# EAGLE design hello (EAGLE 7.5.0)
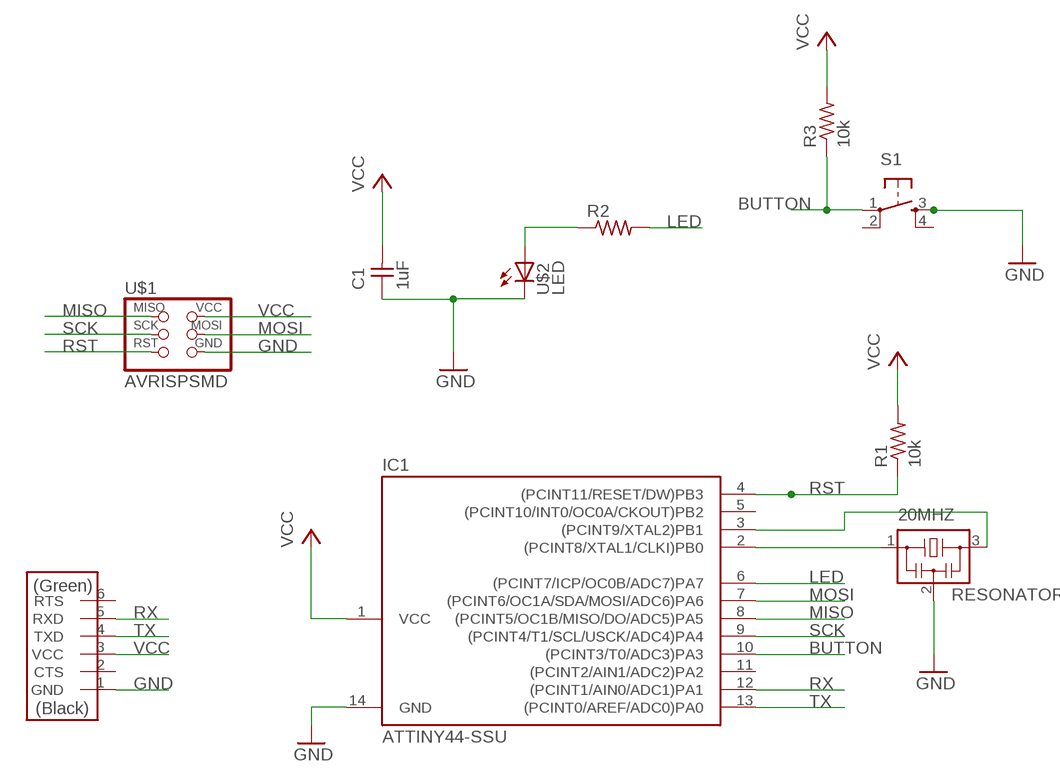
[diagram p0: schematic, sheet 1]

## Parts
20MHZ  RESONATOR  [EFOBM]
C1  1uF  CAP-UNPOLARIZED  [C1206]
IC1  ATTINY44-SSU  [SOIC14]
R1  10k  RES-US1206  [R1206]
R2  RES-US1206  [R1206]
R3  10k  RES-US1206  [R1206]
S1  6MM_SWITCH6MM_SWITCH  [6MM_SWITCH]
U$1  AVRISPSMD  [2X03SMD]
U$2  LED  [LED1206]
U$4  FTDI-SMD-HEADER  [1X06SMD]

## Nets
BUTTON: IC1.10((PCINT3/T0/ADC3)PA3) R3.1 S1.1(P)
GND: 20MHZ.2 C1.1 IC1.14(GND) S1.3(S) U$1.6(GND) U$2.2(C) U$4.1(GND)
LED: IC1.6((PCINT7/ICP/OC0B/ADC7)PA7) R2.2
MISO: IC1.8((PCINT5/OC1B/MISO/DO/ADC5)PA5) U$1.1(MISO)
MOSI: IC1.7((PCINT6/OC1A/SDA/MOSI/ADC6)PA6) U$1.4(MOSI)
N$1: R2.1 U$2.1(A)
N$5: 20MHZ.3 IC1.3((PCINT9/XTAL2)PB1)
N$6: 20MHZ.1 IC1.2((PCINT8/XTAL1/CLKI)PB0)
RST: IC1.4((PCINT11/RESET/DW)PB3) R1.1 U$1.5(RST)
RX: IC1.12((PCINT1/AIN0/ADC1)PA1) U$4.5(RXD)
SCK: IC1.9((PCINT4/T1/SCL/USCK/ADC4)PA4) U$1.3(SCK)
TX: IC1.13((PCINT0/AREF/ADC0)PA0) U$4.4(TXD)
VCC: C1.2 IC1.1(VCC) R1.2 R3.2 U$1.2(VCC) U$4.3(VCC)
Unconnected: IC1.5((PCINT10/INT0/OC0A/CKOUT)PB2) IC1.11((PCINT2/AIN1/ADC2)PA2) S1.2(P1) S1.4(S1) U$4.2(CTS) U$4.6(RTS)

## Library data of the parts
20MHZ = fab:RESONATOR
C1 = fab:CAP-UNPOLARIZED
IC1 = fab:ATTINY44
R1-R3 = fab:RES-US: Resistor (US Symbol) Variants with postfix FAB are widened to allow the routing of internal traces
S1 = fab:6MM_SWITCH: OMRON SWITCH
U$1 = fab:AVRISP
U$2 = fab:LED: LED
U$4 = fab:FTDI-SMD-HEADER

## Board
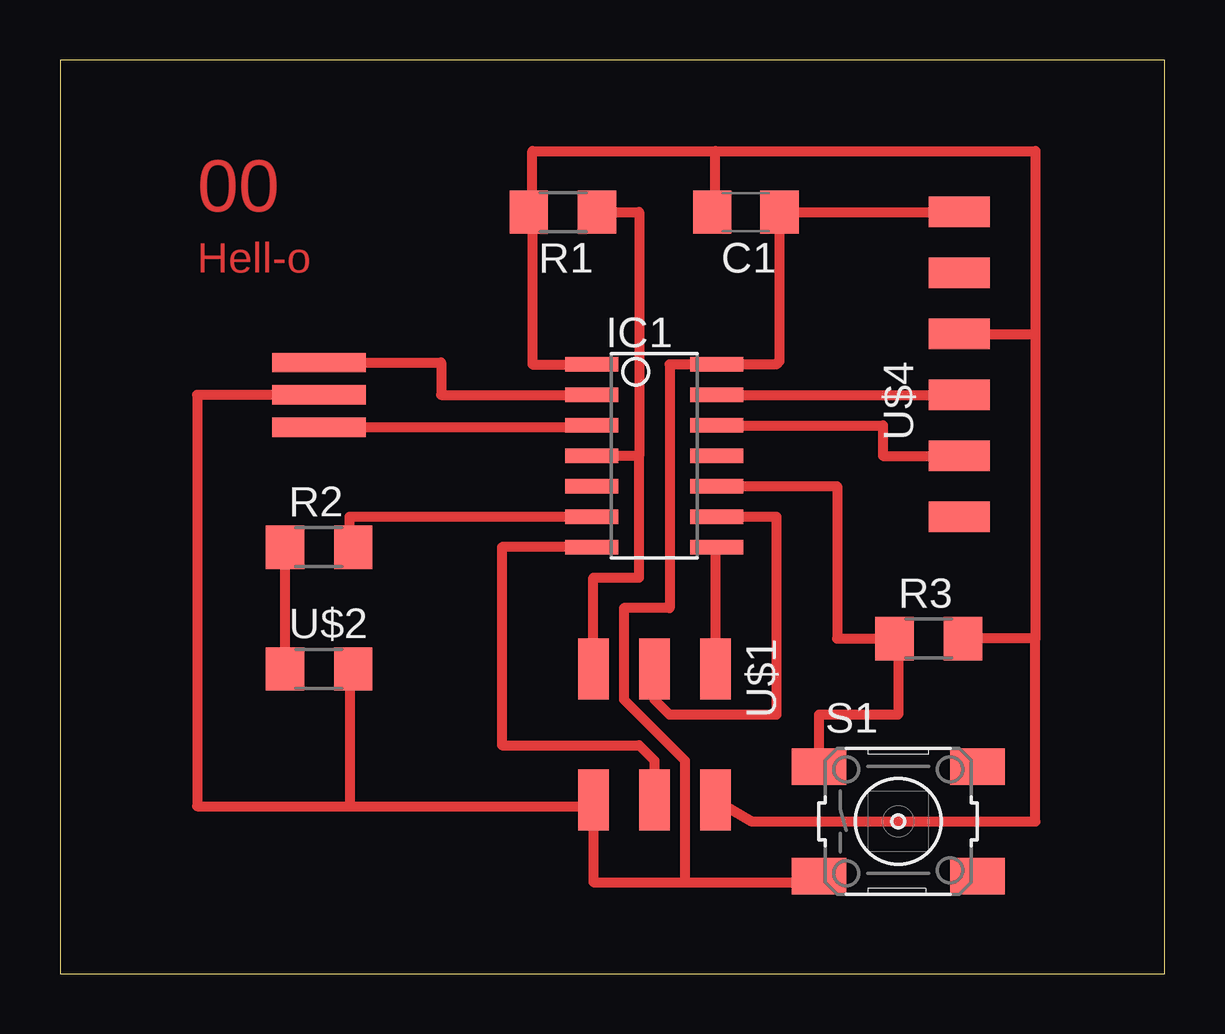
[diagram p1: board, top side]

Size 46.02 x 38.09 mm. Coordinates in mm from the lower left corner, seen from the top.
Outline: 0,0 46.02,0 46.02,38.09 0,38.09 0,0
Copper layers (1*16): Top 0.035mm / dielectric 1.5mm / Bottom 0.035mm
Design rules "default": minimum track width 10mil, minimum drill 24mil, track to track 8mil, track to pad 8mil, pad to pad 8mil, via to via 8mil, smd to smd 8mil, copper to edge 40mil, drill to drill 8mil, minimum pad ring 10mil, minimum via ring 8mil, stop-mask expansion 4mil, vias tented up to drill 0mil, thermal gap 10mil

### Footprints (pad centres in the part's own frame; a part is rotated, then mirrored left to right if it is on the bottom)
EFOBM = smd 0.8 x 3.9: 1 -1.35,0; 2 0,0; 3 1.35,0
C1206 = smd 1.6 x 1.8: 1 -1.4,0; 2 1.4,0
SOIC14 = smd 0.61 x 2.21: 1 -3.81,-2.603; 2 -2.54,-2.603; 3 -1.27,-2.603; 4 0,-2.603; 5 1.27,-2.603; 6 2.54,-2.603; 7 3.81,-2.603; 8 3.81,2.603; 9 2.54,2.603; 10 1.27,2.603; 11 0,2.603; 12 -1.27,2.603; 13 -2.54,2.603; 14 -3.81,2.603
R1206 = smd 1.6 x 1.803: 1 -1.422,0; 2 1.422,0
6MM_SWITCH = smd 2.286 x 1.524: 1 -3.302,2.286; 2 3.302,2.286; 3 -3.302,-2.286; 4 3.302,-2.286
2X03SMD = smd 2.54 x 1.27: 1 -2.54,2.54; 2 2.92,2.54; 3 -2.54,0; 4 2.92,0; 5 -2.54,-2.54; 6 2.92,-2.54
LED1206 = smd 1.6 x 1.803: 1 -1.422,0; 2 1.422,0
1X06SMD = smd 2.54 x 1.27: 1 0,6.35; 2 0,3.81; 3 0,1.27; 4 0,-1.27; 5 0,-3.81; 6 0,-6.35

### Placement (x,y rotation side)
20MHZ  10.8,24.13 270 top
C1  28.58,31.75 180 top
IC1  24.77,21.59 270 top
R1  20.96,31.75 180 top
R2  10.8,17.78 0 top
R3  36.2,13.97 0 top
S1  34.92,6.35 0 top
U$1  24.77,10.16 270 top
U$2  10.8,12.7 0 top
U$4  37.47,25.4 0 top

### Tracks (layer width: path | path; a pad name or v marks a point on that pad's centre or on a via)
BUTTON
  Top 0.406: IC1.10 32.38,20.32 32.38,13.97 R3.1 34.92,13.97 34.92,10.79 31.62,10.79 S1.1
GND
  Top 0.406: U$4.1 C1.1 29.98,25.53 29.84,25.4 IC1.14 25.4,25.4 25.4,15.24 23.5,15.24 23.5,11.43 26.04,8.89 26.04,3.81 | 26.04,3.81 22.23,3.81 U$1.6 22.23,6.99 12.07,6.99 | 26.04,3.81 31.62,3.81 S1.3 | 20MHZ.2 5.71,24.13 5.71,6.99 12.07,6.99 | U$2.2 12.07,12.7 12.07,6.99
LED
  Top 0.406: R2.2 12.07,17.78 12.07,19.05 IC1.6
MISO
  Top 0.406: IC1.8 27.3,17.72 U$1.1
MOSI
  Top 0.406: IC1.7 18.41,17.78 18.41,9.53 24.13,9.53 24.77,8.89 U$1.4
N$1
  Top 0.406: R2.1 U$2.1
N$5
  Top 0.406: 20MHZ.3 22.16,22.78 IC1.3
N$6
  Top 0.406: 20MHZ.1 15.88,25.48 15.88,24.13 IC1.2
RST
  Top 0.406: R1.1 24.13,31.75 24.13,21.59 | 24.13,21.59 IC1.4 | U$1.5 22.23,16.51 24.13,16.51 24.13,21.59
RX
  Top 0.406: IC1.12 34.29,22.86 34.29,21.59 U$4.5
SCK
  Top 0.406: IC1.9 29.84,19.05 29.84,10.79 25.4,10.79 24.77,11.43 U$1.3
TX
  Top 0.406: IC1.13 U$4.4
VCC
  Top 0.406: R1.2 19.69,31.75 | 19.69,31.75 19.69,34.29 27.3,34.29 | 27.3,34.29 40.64,34.29 40.64,26.67 | C1.2 27.3,31.75 27.3,34.29 | U$4.3 40.64,26.67 | 40.64,26.67 40.64,13.97 | 40.64,13.97 R3.2 | U$1.2 28.83,6.35 40.64,6.35 40.64,13.97 | 19.69,31.75 19.69,25.4 IC1.1

### Text on the board
Top: 00 | Hell-o